# Altium schematic sheet DRV8305.SchDoc
size A4
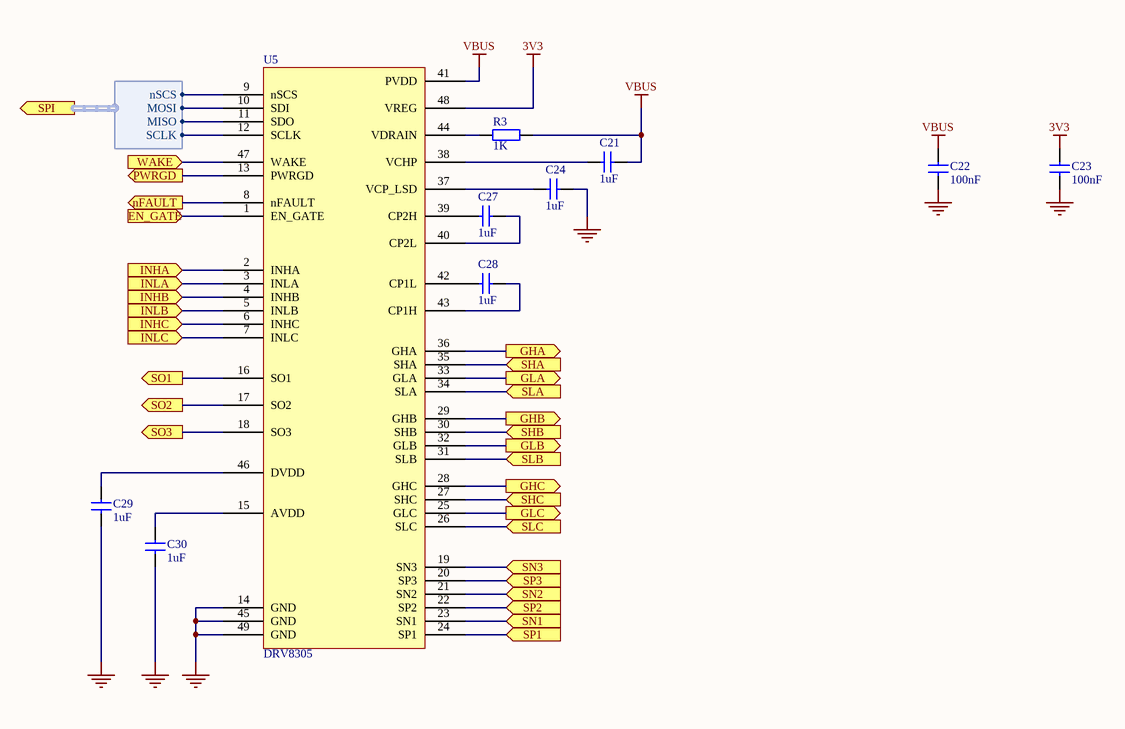
[diagram p0: DRV8305.SchDoc]

## Parts
C21  1uF  [CAP0402(1005)_N]
C22  100nF  [CAP0402(1005)_N]
C23  100nF  [CAP0402(1005)_N]
C24  1uF  [CAP0402(1005)_N]
C27  1uF  [CAP0402(1005)_N]
C28  1uF  [CAP0402(1005)_N]
C29  1uF  [CAP0402(1005)_N]
C30  1uF  [CAP0402(1005)_N]
R3  1K  [RESC0603(1608)_N]
U5  DRV8305  [S-PQFP-G48]

## Ports
EN_GATE (in), GHA (out), GHB (out), GHC (out), GLA (out), GLB (out), GLC (out), INHA (in), INHB (in), INHC (in), INLA (in), INLB (in), INLC (in), nFAULT (out), PWRGD (out), SHA (in), SHB (in), SHC (in), SLA (in), SLB (in), SLC (in), SN1 (in), SN2 (in), SN3 (in), SO1 (out), SO2 (out), SO3 (out), SP1 (in), SP2 (in), SP3 (in), SPI (out, harness SPI), WAKE (in)

## Harnesses
SPI: nSCS, MOSI, MISO, SCLK

## Nets
3V3: C23.2 U5.48(VREG)
GND: C22.1 C23.1 C24.1 C29.1 C30.1 U5.14(GND) U5.45(GND) U5.49(GND)
VBUS: C21.1 C22.2 R3.2 U5.41(PVDD)
EN_GATE: U5.1(EN_GATE) ; port EN_GATE
GHA: U5.36(GHA) ; port GHA
GHB: U5.29(GHB) ; port GHB
GHC: U5.28(GHC) ; port GHC
GLA: U5.33(GLA) ; port GLA
GLB: U5.32(GLB) ; port GLB
GLC: U5.25(GLC) ; port GLC
INHA: U5.2(INHA) ; port INHA
INHB: U5.4(INHB) ; port INHB
INHC: U5.6(INHC) ; port INHC
INLA: U5.3(INLA) ; port INLA
INLB: U5.5(INLB) ; port INLB
INLC: U5.7(INLC) ; port INLC
nFAULT: U5.8(nFAULT) ; port nFAULT
PWRGD: U5.13(PWRGD) ; port PWRGD
SHA: U5.35(SHA) ; port SHA
SHB: U5.30(SHB) ; port SHB
SHC: U5.27(SHC) ; port SHC
SLA: U5.34(SLA) ; port SLA
SLB: U5.31(SLB) ; port SLB
SLC: U5.26(SLC) ; port SLC
SN1: U5.23(SN1) ; port SN1
SN2: U5.21(SN2) ; port SN2
SN3: U5.19(SN3) ; port SN3
SO1: U5.16(SO1) ; port SO1
SO2: U5.17(SO2) ; port SO2
SO3: U5.18(SO3) ; port SO3
SP1: U5.24(SP1) ; port SP1
SP2: U5.22(SP2) ; port SP2
SP3: U5.20(SP3) ; port SP3
WAKE: U5.47(WAKE) ; port WAKE
NetC21_2: C21.2 U5.38(VCHP)
NetC24_2: C24.2 U5.37(VCP_LSD)
NetC27_1: C27.1 U5.40(CP2L)
NetC27_2: C27.2 U5.39(CP2H)
NetC28_1: C28.1 U5.43(CP1H)
NetC28_2: C28.2 U5.42(CP1L)
NetC29_2: C29.2 U5.46(DVDD)
NetC30_2: C30.2 U5.15(AVDD)
NetR3_1: R3.1 U5.44(VDRAIN)
NetU5_9: U5.9(nSCS) ; port SPI.nSCS
NetU5_10: U5.10(SDI) ; port SPI.MOSI
NetU5_11: U5.11(SDO) ; port SPI.MISO
NetU5_12: U5.12(SCLK) ; port SPI.SCLK

## Library data of the parts
C21-C24 C27-C30 = cap_generic: Capacitor; Part: cap_generic; Mounting Technology: Surface Mount
  C21 C24 C27-C30: PartValue: 1uF
  C22 C23: PartValue: 100nF
R3 = res_0603: Resistor; PartNumber: *; Manufacturer: *; Mounting Technology: Surface Mount; Digikey Part Number: *; Part: res_0603; PartValue: 1K
U5 = DRV8305: Manufacturer: Texas Instruments; Part: DRV8305